# EAGLE design proj (EAGLE 9.5.2)
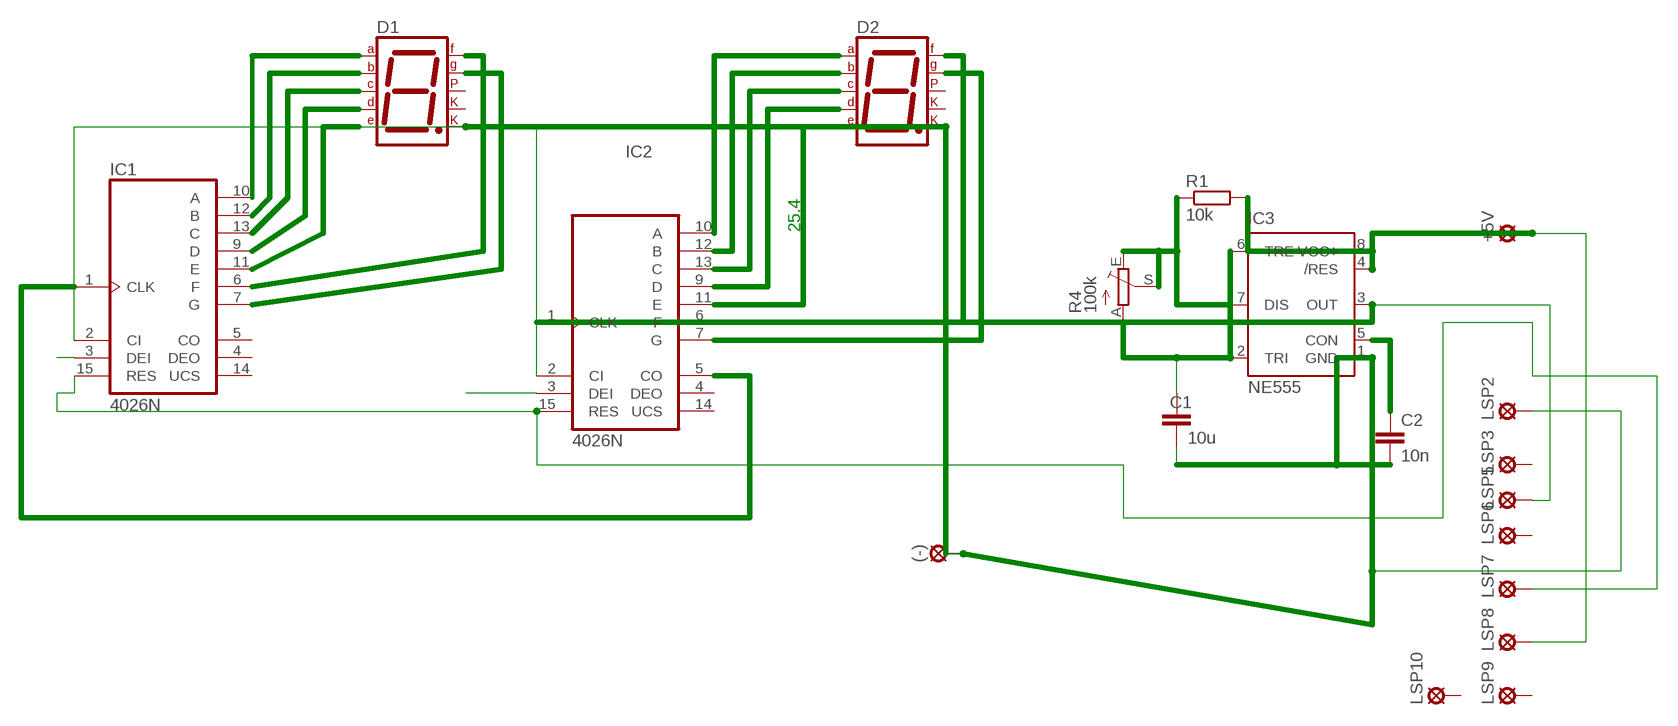
[diagram p0: schematic, sheet 1]

## Parts
(-)  SE11  [SE11]
+5V  SE11  [SE11]
C1  10u  C2.5/2  [C2.5-2]
C2  10n  C2.5/2  [C2.5-2]
D1  7SEG-CK  [7SEG-13]
D2  7SEG-CK  [7SEG-13]
IC1  4026N  [DIL16]
IC2  4026N  [DIL16]
IC3  NE555  [DIL-08]
LSP2  SE11  [SE11]
LSP3  SE11  [SE11]
LSP5  SE11  [SE11]
LSP6  SE11  [SE11]
LSP7  SE11  [SE11]
LSP8  SE11  [SE11]
LSP9  SE11  [SE11]
LSP10  SE11  [SE11]
R1  10k  R-EU_0204/7  [0204/7]
R4  100k  TRIM_EU-RJ9W  [RJ9W]

## Nets
N$1: D1.7(A) IC1.10(A)
N$2: D1.6(B) IC1.12(B)
N$3: D1.4(C) IC1.13(C)
N$4: D1.2(D) IC1.9(D)
N$5: D1.1(E) IC1.11(E)
N$6: D1.9(F) IC1.6(F)
N$7: D1.10(G) IC1.7(G)
N$8: D2.7(A) IC2.10(A)
N$9: D2.6(B) IC2.12(B)
N$10: D2.4(C) IC2.13(C)
N$11: D2.2(D) IC2.9(D)
N$12: D2.1(E) IC2.11(E)
N$13: D2.9(F) IC2.6(F)
N$14: D2.10(G) IC2.7(G)
N$15: (-).MP C1.2 C2.2 D1.8(CK2) D2.8(CK2) IC1.2(CI) IC2.2(CI) IC3.1(GND) LSP2.MP
N$16: IC1.1(CLK) IC2.5(CO)
N$17: +5V.MP IC3.4(/RES) IC3.8(VCC+) LSP8.MP R1.2
N$18: IC3.7(DIS) R1.1 R4.E R4.S
N$19: C1.1 IC3.2(TRI) IC3.6(TRE) R4.A
N$20: C2.1 IC3.5(CON)
N$21: IC2.1(CLK) IC3.3(OUT) LSP5.MP
N$22: IC1.3(DEI)
N$23: IC1.15(RES) IC2.15(RES) LSP7.MP
VDD: IC2.3(DEI)
Unconnected: D1.3(CK1) D1.5(DP) D2.3(CK1) D2.5(DP) IC1.4(DEO) IC1.5(CO) IC1.14(UCS) IC2.4(DEO) IC2.14(UCS) LSP3.MP LSP6.MP LSP9.MP LSP10.MP

## Power pins joined to a net without a drawn wire
VDD: IC1.16(VDD) IC2.16(VDD)
VSS: IC1.8(VSS) IC2.8(VSS)

## Library data of the parts
(-) +5V LSP2 LSP3 LSP5-LSP10 = solpad:SE11: SOLDER PAD RTM, drill 1,1mm, distributor Buerklin, 07F810
C1 C2 = capacitor-wima:C: CAPACITOR naming: grid - package width
D1 D2 = special:7SEG-CK: 7-segment DISPLAY single cathode, 13 mm
IC1 IC2 = 40xx:4026: Decade COUNTER/DIVIDER, 7-seg. outputs
IC3 = st-microelectronics:NE555: General purpose bipolar Timer; MF: Arrow Electronics; MPN: NE555N; OC_FARNELL: 1467742; OC_NEWARK: 89K1486
R1 = rcl:R-EU_: RESISTOR, European symbol; SPICEPREFIX: R
R4 = pot:TRIM_EU-: POTENTIOMETER

## Board
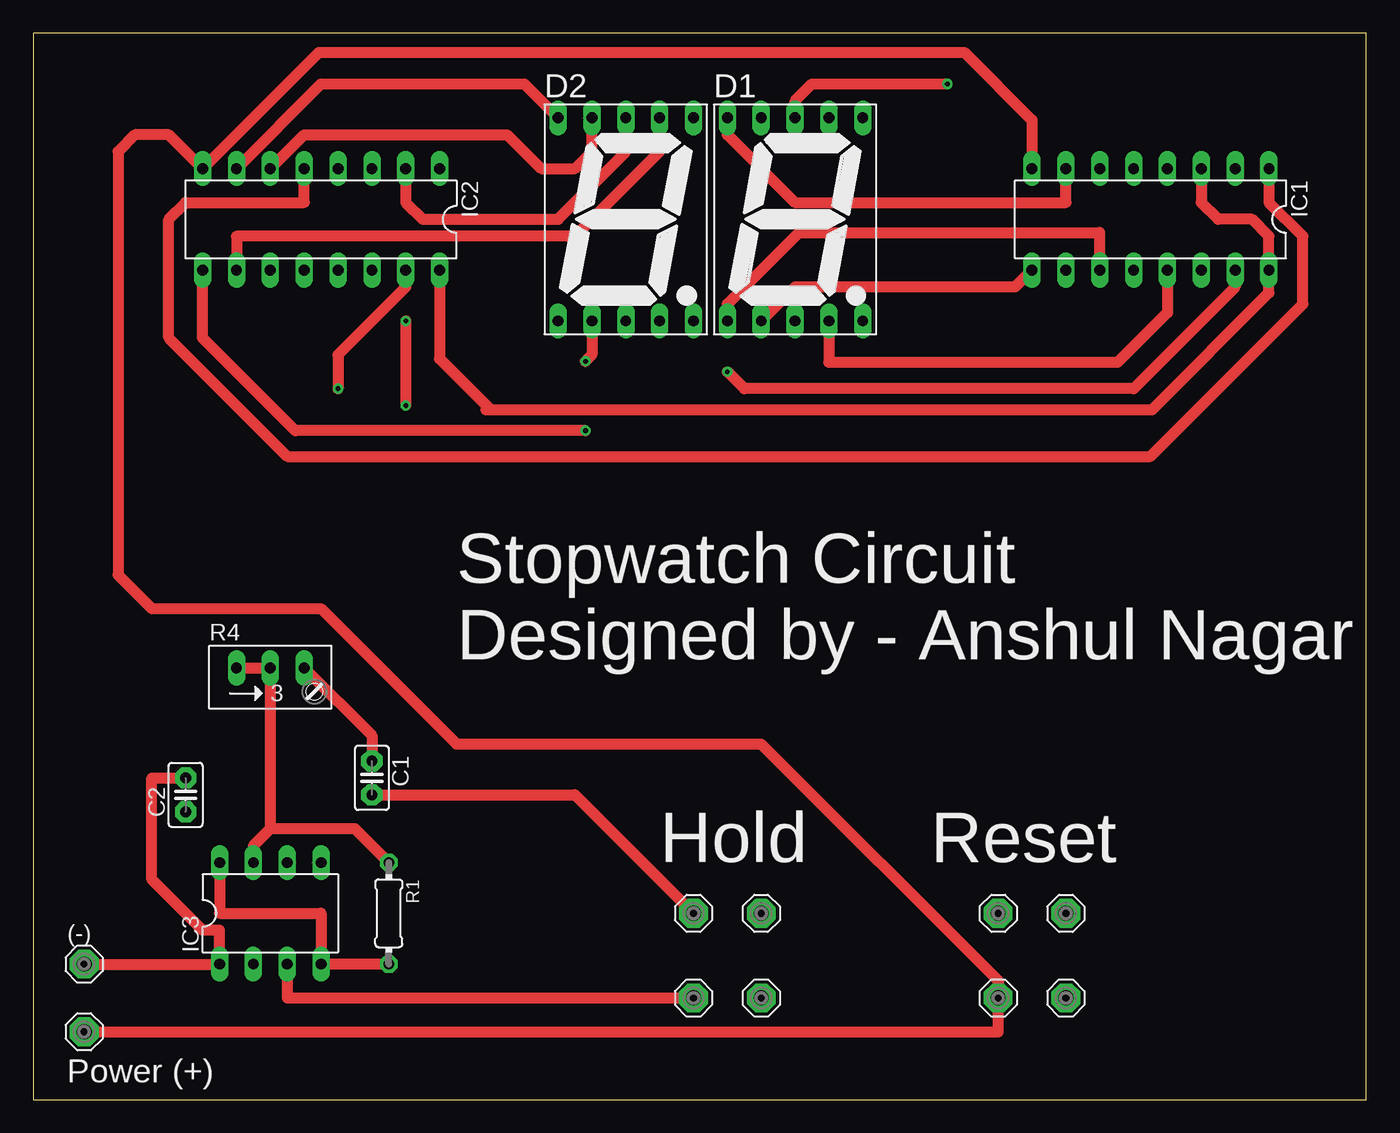
[diagram p1: board, top side]
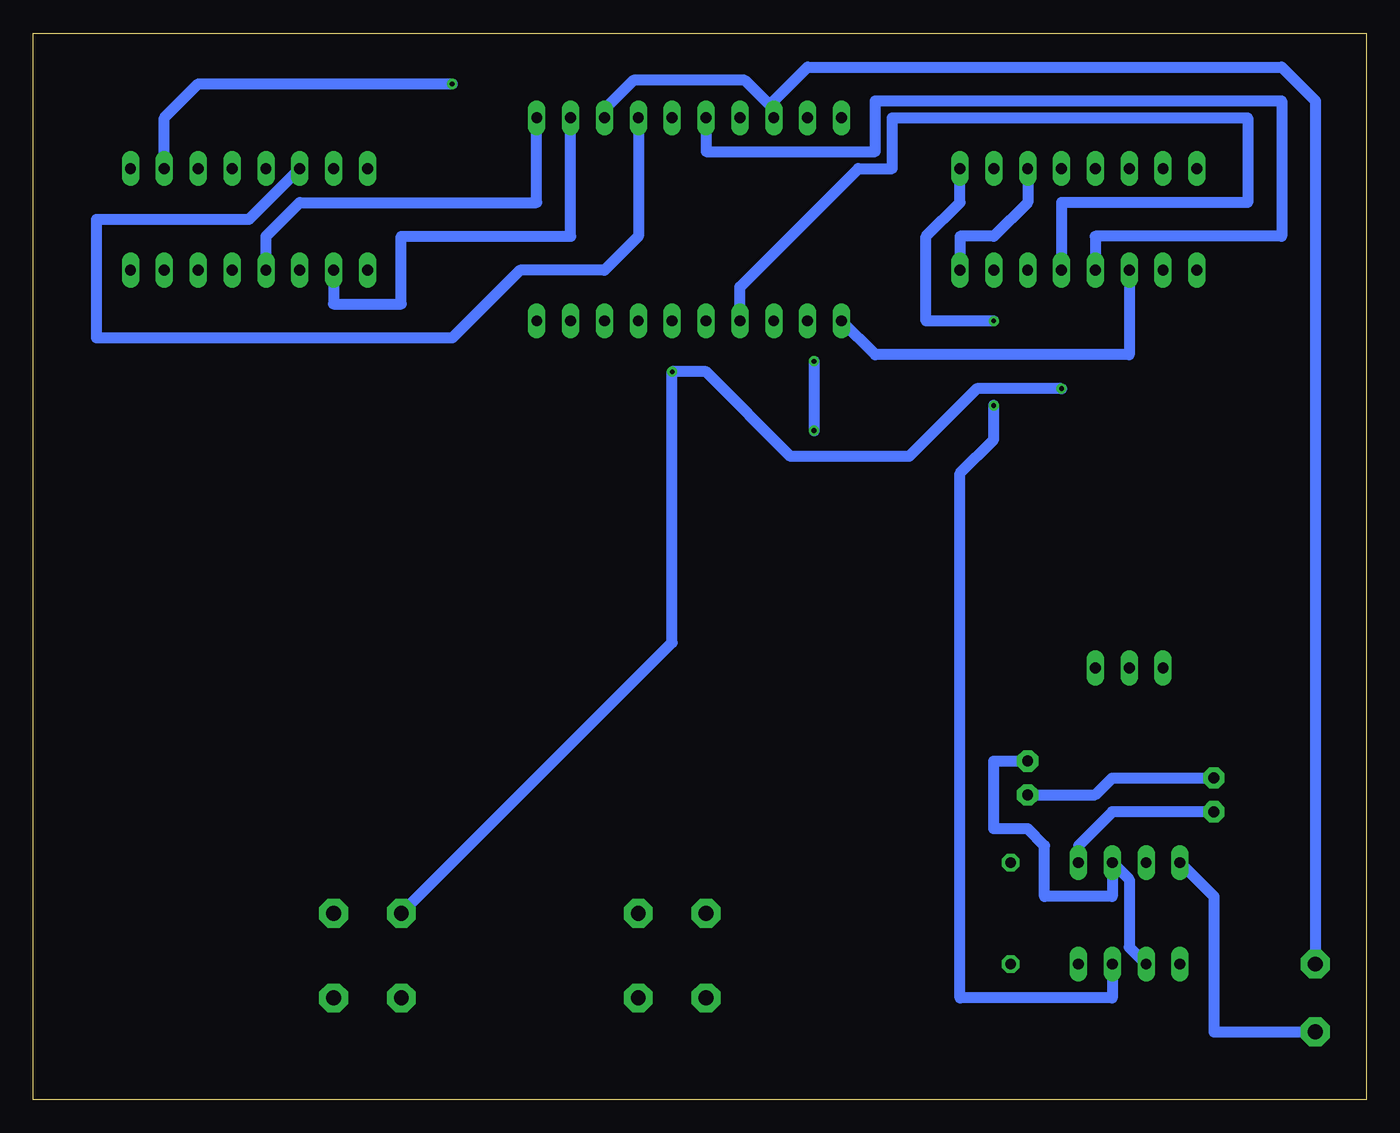
[diagram p2: board, bottom side, seen from below]

Size 100 x 80 mm. Coordinates in mm from the lower left corner, seen from the top.
Outline: 0,0 100,0 100,80 0,80 0,0
Copper layers (1*16): Top 0.035mm / dielectric 1.5mm / Bottom 0.035mm
Design rules "default": minimum track width 6mil, minimum drill 0.35mm, track to track 6mil, track to pad 6mil, pad to pad 6mil, via to via 6mil, smd to smd 6mil, copper to edge 40mil, drill to drill 6mil, minimum pad ring 10mil, minimum via ring 8mil, stop-mask expansion 4mil, vias tented up to drill 0mil, thermal gap 10mil

### Footprints (pad centres in the part's own frame; a part is rotated, then mirrored left to right if it is on the bottom)
SE11 = drill 1.118 pad 2.159 octagon: MP 0,0
C2.5-2 = drill 0.813 pad 1.6 octagon: 1 -1.27,0; 2 1.27,0
7SEG-13 = drill 0.813 long: 1 -5.08,-7.62; 2 -2.54,-7.62; 3 0,-7.62; 4 2.54,-7.62; 5 5.08,-7.62; 6 5.08,7.62; 7 2.54,7.62; 8 0,7.62; 9 -2.54,7.62; 10 -5.08,7.62
DIL16 = drill 0.813 long: 1 -8.89,-3.81; 2 -6.35,-3.81; 3 -3.81,-3.81; 4 -1.27,-3.81; 5 1.27,-3.81; 6 3.81,-3.81; 7 6.35,-3.81; 8 8.89,-3.81; 9 8.89,3.81; 10 6.35,3.81; 11 3.81,3.81; 12 1.27,3.81; 13 -1.27,3.81; 14 -3.81,3.81; 15 -6.35,3.81; 16 -8.89,3.81
DIL-08 = drill 0.813 long: 1 -3.81,-3.81; 2 -1.27,-3.81; 3 1.27,-3.81; 4 3.81,-3.81; 5 3.81,3.81; 6 1.27,3.81; 7 -1.27,3.81; 8 -3.81,3.81
0204/7 = drill 0.813 octagon: 1 -3.81,0; 2 3.81,0
RJ9W = drill 0.813 long: A 2.54,0.635; E -2.54,0.635; S 0,0.635

### Placement (x,y rotation side)
(-)  3.81,10.16 0 top
+5V  3.81,5.08 0 top
C1  25.4,24.13 270 top
C2  11.43,22.86 90 top
D1  57.15,66.04 0 top
D2  44.45,66.04 0 top
IC1  83.82,66.04 180 top
IC2  21.59,66.04 180 top
IC3  17.78,13.97 0 top
LSP2  49.53,13.97 0 top
LSP3  54.61,13.97 0 top
LSP5  49.53,7.62 0 top
LSP6  54.61,7.62 0 top
LSP7  72.39,13.97 0 top
LSP8  72.39,7.62 0 top
LSP9  77.47,7.62 0 top
LSP10  77.47,13.97 0 top
R1  26.67,13.97 270 top
R4  17.78,31.75 0 top

### Tracks (layer width: path | path; a pad name or v marks a point on that pad's centre or on a via)
N$1
  Bottom 0.813: IC1.10 77.47,59.69 72.39,59.69 72.39,64.77 59.69,64.77 D1.7
N$2
  Bottom 0.813: IC1.12 82.55,64.77 80.01,67.31 62.23,67.31 D1.6
N$3
  Top 0.813: D1.4 59.69,55.3 81.34,55.3 85.09,59.04 IC1.13
N$4
  Top 0.813: D1.2 57.15,60.96 73.66,60.96 IC1.9
N$5
  Top 0.813: D1.1 52.07,59.69 57.43,65.05 80.01,65.05 IC1.11
N$6
  Bottom 0.813: IC1.6 83.82,66.04 95.25,66.04 95.25,57.15 68.58,57.15 63.5,62.23 57.15,62.23 54.61,64.77 D1.9
N$7
  Top 0.813: D1.10 52.07,72.39 57.15,67.31 77.47,67.31 IC1.7
N$8
  Top 0.813: D2.7 46.99,71.12 40.64,64.77 15.24,64.77 IC2.10
N$9
  Bottom 0.813: D2.6 49.53,71.12 36.83,71.12 36.83,74.93 6.35,74.93 6.35,64.77 20.32,64.77 IC2.12
N$10
  Top 0.152: 23.48,62.23 IC2.13
  Bottom 0.813: D2.4 46.99,60.96 38.1,69.85 35.56,69.85 35.56,73.66 8.89,73.66 8.89,67.31 22.86,67.31 IC2.13
N$11  (via drill 0.35)
  Top 0.813: D2.2 41.91,55.88 v41.43,55.4 | v41.43,50.19 19.66,50.19 12.7,57.15 IC2.9
  Bottom 0.813: v41.43,55.4 v41.43,50.19
N$12
  Bottom 0.813: IC2.11 17.78,55.88 36.83,55.88 D2.1
N$13
  Top 0.152: 41.29,73.66 D2.9
  Top 0.813: IC2.6 20.32,72.39 35.56,72.39 38.1,69.85 40.64,69.85 41.91,71.12 D2.9
N$14
  Top 0.813: D2.10 36.83,76.2 21.59,76.2 IC2.7
N$15  (via drill 0.35)
  Top 0.152: 10.4,24.13 C2.2
  Top 0.813: (-).MP IC3.1 13.97,12.7 12.7,12.7 8.89,16.51 8.89,24.13 C2.2 | IC2.2 27.94,67.31 29.21,66.04 39.37,66.04 44.45,71.12 D2.8 | D1.8 57.15,74.93 58.42,76.2 v68.58,76.2 | LSP2.MP 40.64,22.86 C1.2
  Bottom 0.813: D1.8 57.15,74.31 54.98,76.48 46.62,76.48 44.45,74.31 D2.8 44.45,74.93 41.91,77.47 6.35,77.47 3.81,74.93 (-).MP | C2.2 19.05,24.13 20.32,22.86 C1.2 | IC1.2 90.17,73.66 87.63,76.2 v68.58,76.2
N$16
  Top 0.813: IC1.1 92.71,67.31 95.25,64.77 95.25,59.69 83.82,48.26 19.05,48.26 10.16,57.15 10.16,66.04 11.43,67.31 20.32,67.31 IC2.5
N$17
  Top 0.152: +5V.MP 4.09,5.08
  Top 0.813: IC3.8 13.97,13.97 21.59,13.97 IC3.4 R1.2 | +5V.MP 72.39,5.08 LSP8.MP
  Bottom 0.813: IC3.8 11.43,15.24 11.43,5.08 +5V.MP
N$18
  Top 0.813: R4.E R4.S 17.78,20.32 | 17.78,20.32 16.51,19.05 IC3.7 | R1.1 24.13,20.32 17.78,20.32
N$19
  Top 0.152: IC3.6 19.67,17.78
  Top 0.813: R4.A 25.4,27.3 C1.1
  Bottom 0.813: IC3.2 17.78,11.43 17.78,16.51 IC3.6 19.05,15.24 24.13,15.24 24.13,19.05 25.4,20.32 27.94,20.32 27.94,25.4 C1.1
N$20
  Top 0.152: C2.1 12.08,21.59 | 20.97,17.78 IC3.5
  Bottom 0.813: C2.1 19.05,21.59 21.59,19.05 IC3.5
N$21  (via drill 0.35)
  Top 0.813: v27.94,58.42 v27.94,52.07 | IC3.3 19.05,7.62 LSP5.MP
  Bottom 0.813: IC3.3 19.05,7.62 30.48,7.62 30.48,46.99 27.94,49.53 v27.94,52.07 | IC2.1 30.48,67.31 33.02,64.77 33.02,58.42 v27.94,58.42
N$23  (via drill 0.35)
  Top 0.813: IC1.15 90.17,60.96 82.55,53.34 53.34,53.34 v52.07,54.61 | IC2.15 27.94,60.96 22.86,55.88 v22.86,53.34
  Bottom 0.813: v22.86,53.34 29.21,53.34 34.29,48.26 43.18,48.26 49.53,54.61 v52.07,54.61 52.07,34.29 LSP7.MP
VDD
  Top 0.813: 33.95,51.77 34.29,51.77 | 34.29,51.77 83.95,51.77 92.71,60.53 IC1.16 92.71,64.77 91.44,66.04 88.9,66.04 87.63,67.31 87.63,69.85 | 34.29,51.77 30.48,55.58 IC2.16
  Bottom 0.813: IC2.3 25.4,67.31 27.94,64.77 30.48,64.77 IC2.16
VSS
  Top 0.813: IC1.8 74.93,73.5 69.85,78.58 21.43,78.58 IC2.8 10.16,72.39 7.62,72.39 6.35,71.12 6.35,39.37 8.89,36.83 21.59,36.83 31.75,26.67 54.61,26.67 72.39,8.89 72.39,7.62

### Text on the board
tNames: Stopwatch Circuit / Designed by - Anshul Nagar | Hold | Reset | Power (+)